# Altium schematic sheet MASTER_HW.SchDoc
size A4; SheetNumber: 1; SheetTotal: 4
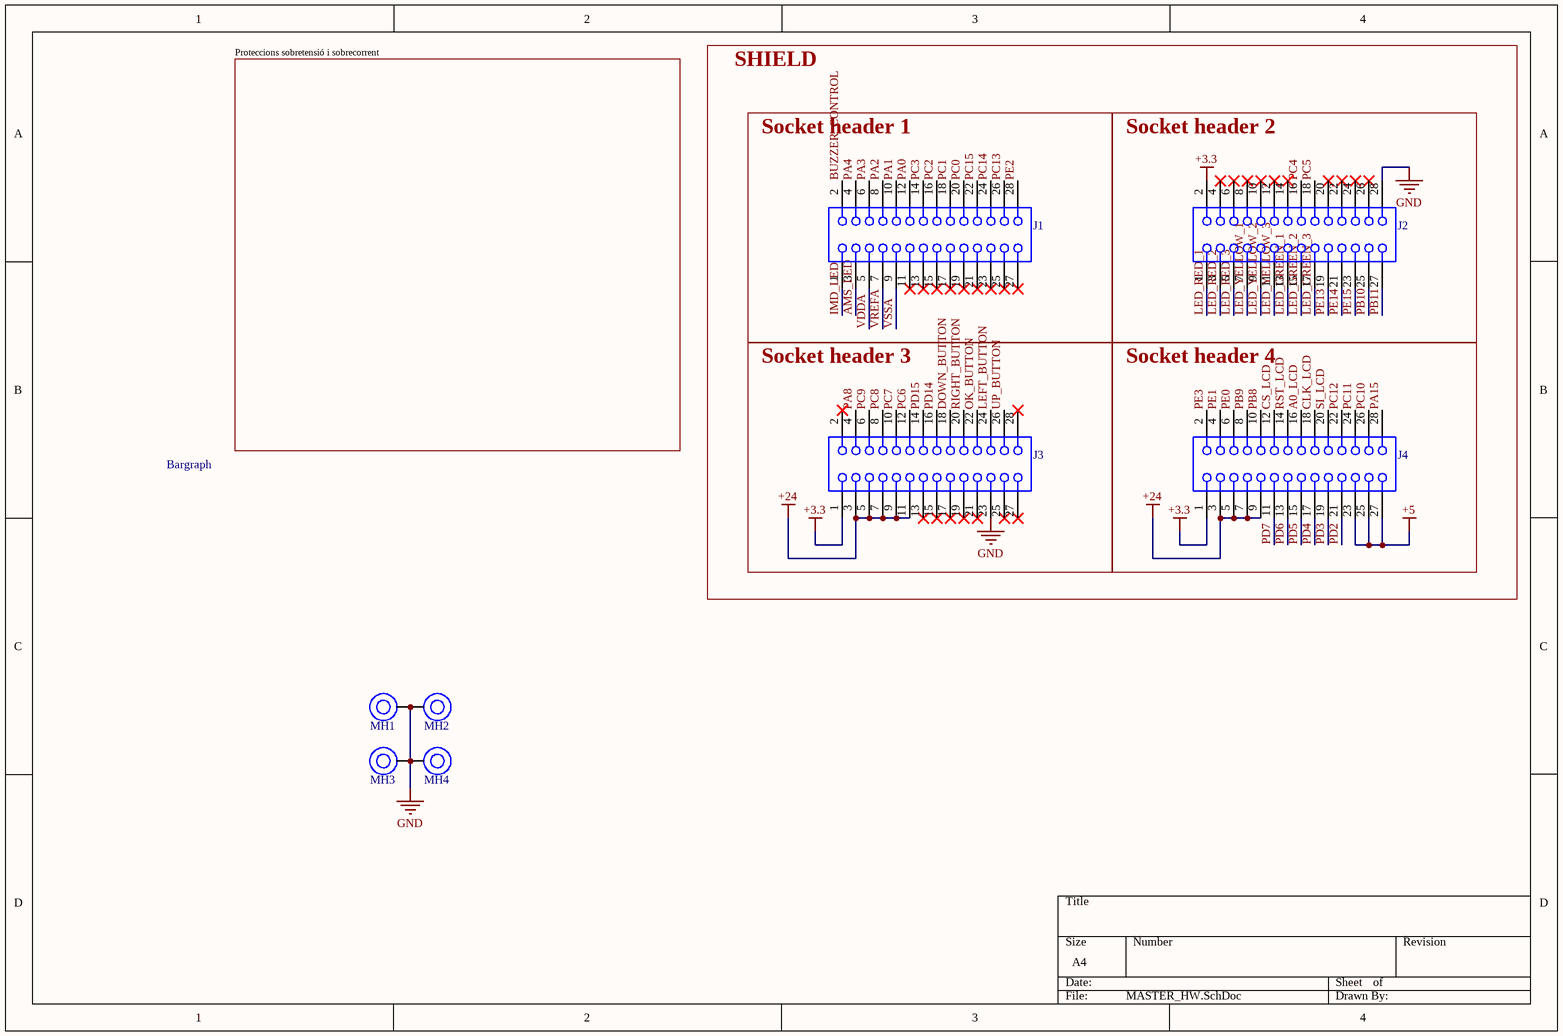
[diagram p0: MASTER_HW.SchDoc]

## Parts
J1  62332821021  [62332821021]  (value not drawn)
J2  62332821021  [62332821021]  (value not drawn)
J3  62332821021  [62332821021]  (value not drawn)
J4  62332821021  [62332821021]  (value not drawn)
MH1  Mounting_Hole_M3  [Mounting_Hole_M3]  (value not drawn)
MH2  Mounting_Hole_M3  [Mounting_Hole_M3]  (value not drawn)
MH3  Mounting_Hole_M3  [Mounting_Hole_M3]  (value not drawn)
MH4  Mounting_Hole_M3  [Mounting_Hole_M3]  (value not drawn)

## Blocks framed on the sheet
Socket header 1: J1
Socket header 2: J2
Socket header 3: J3
Socket header 4: J4

## Nets
+3.3: J2.2 J3.1 J4.1
+5: J4.23 J4.25 J4.27
+24: J3.3 J3.5 J3.7 J3.9 J3.11 J4.3 J4.5 J4.7 J4.9
GND: J2.28 J3.23 MH1.1 MH2.1 MH3.1 MH4.1
A0_LCD: J4.16
AMS_LED: J1.3
BUZZER_CONTROL: J1.2
CLK_LCD: J4.18
CS_LCD: J4.12
DOWN_BUTTON: J3.18
IMD_LED: J1.1
LED_GREEN_1: J2.13
LED_GREEN_2: J2.15
LED_GREEN_3: J2.17
LED_RED_1: J2.1
LED_RED_2: J2.3
LED_RED_3: J2.5
LED_YELLOW_1: J2.7
LED_YELLOW_2: J2.9
LED_YELLOW_3: J2.11
LEFT_BUTTON: J3.24
OK_BUTTON: J3.22
PA0: J1.12
PA1: J1.10
PA2: J1.8
PA3: J1.6
PA4: J1.4
PA8: J3.4
PA15: J4.28
PB8: J4.10
PB9: J4.8
PB10: J2.25
PB11: J2.27
PC0: J1.20
PC1: J1.18
PC2: J1.16
PC3: J1.14
PC4: J2.16
PC5: J2.18
PC6: J3.12
PC7: J3.10
PC8: J3.8
PC9: J3.6
PC10: J4.26
PC11: J4.24
PC12: J4.22
PC13: J1.26
PC14: J1.24
PC15: J1.22
PD2: J4.21
PD3: J4.19
PD4: J4.17
PD5: J4.15
PD6: J4.13
PD7: J4.11
PD14: J3.16
PD15: J3.14
PE0: J4.6
PE1: J4.4
PE2: J1.28
PE3: J4.2
PE13: J2.19
PE14: J2.21
PE15: J2.23
RIGHT_BUTTON: J3.20
RST_LCD: J4.14
SI_LCD: J4.20
UP_BUTTON: J3.26
VDDA: J1.5
VREFA: J1.7
VSSA: J1.9

Not connected (* = marked no-connect by the designer): J1 11* 13* 15* 17* 19* 21* 23* 25* 27*; J2 4* 6* 8* 10* 12* 14* 20* 22* 24* 26*; J3 2* 13* 15* 17* 19* 21* 25* 27* 28*

## Notes on the sheet
- Proteccions sobretensió i sobrecorrent
- SHIELD
- Bargraph

## Library data of the parts
J1-J4 = 62332821021: WR-PHD Socket Header, SMT, Vertical, pitch 1.27mm, 2 Row, 28P; Manufacturer: Wurth Elektronik; Contact Resistance: 20mΩ; Rated Current: 1A; Working Voltage: 250V; Withstanding Voltage: 500V; ComponentLink1Description: Website Link; ComponentLink1URL: https://www.we-online.com/redexpert/article/62332821021?ad; ComponentLink2Description: Datasheet Link; ComponentLink2URL: https://www.we-online.com/redexpert/spec/62332821021?ad; Manufacturer Part Number: 62332821021; Category: Board-to-Board Connectors; Match Code: WR-PHD; Mount: Surface Mount; Operating Temperature Max: 105°C; Operating Temperature Min: -40°C; Packaging: Tape and Reel; Gender: Socket Header; Number of Pins: 28; Number of Rows: 2; Orientation: Vertical; Pitch: 1.27mm